# EAGLE schematic sensW5 (EAGLE 9.5.1)
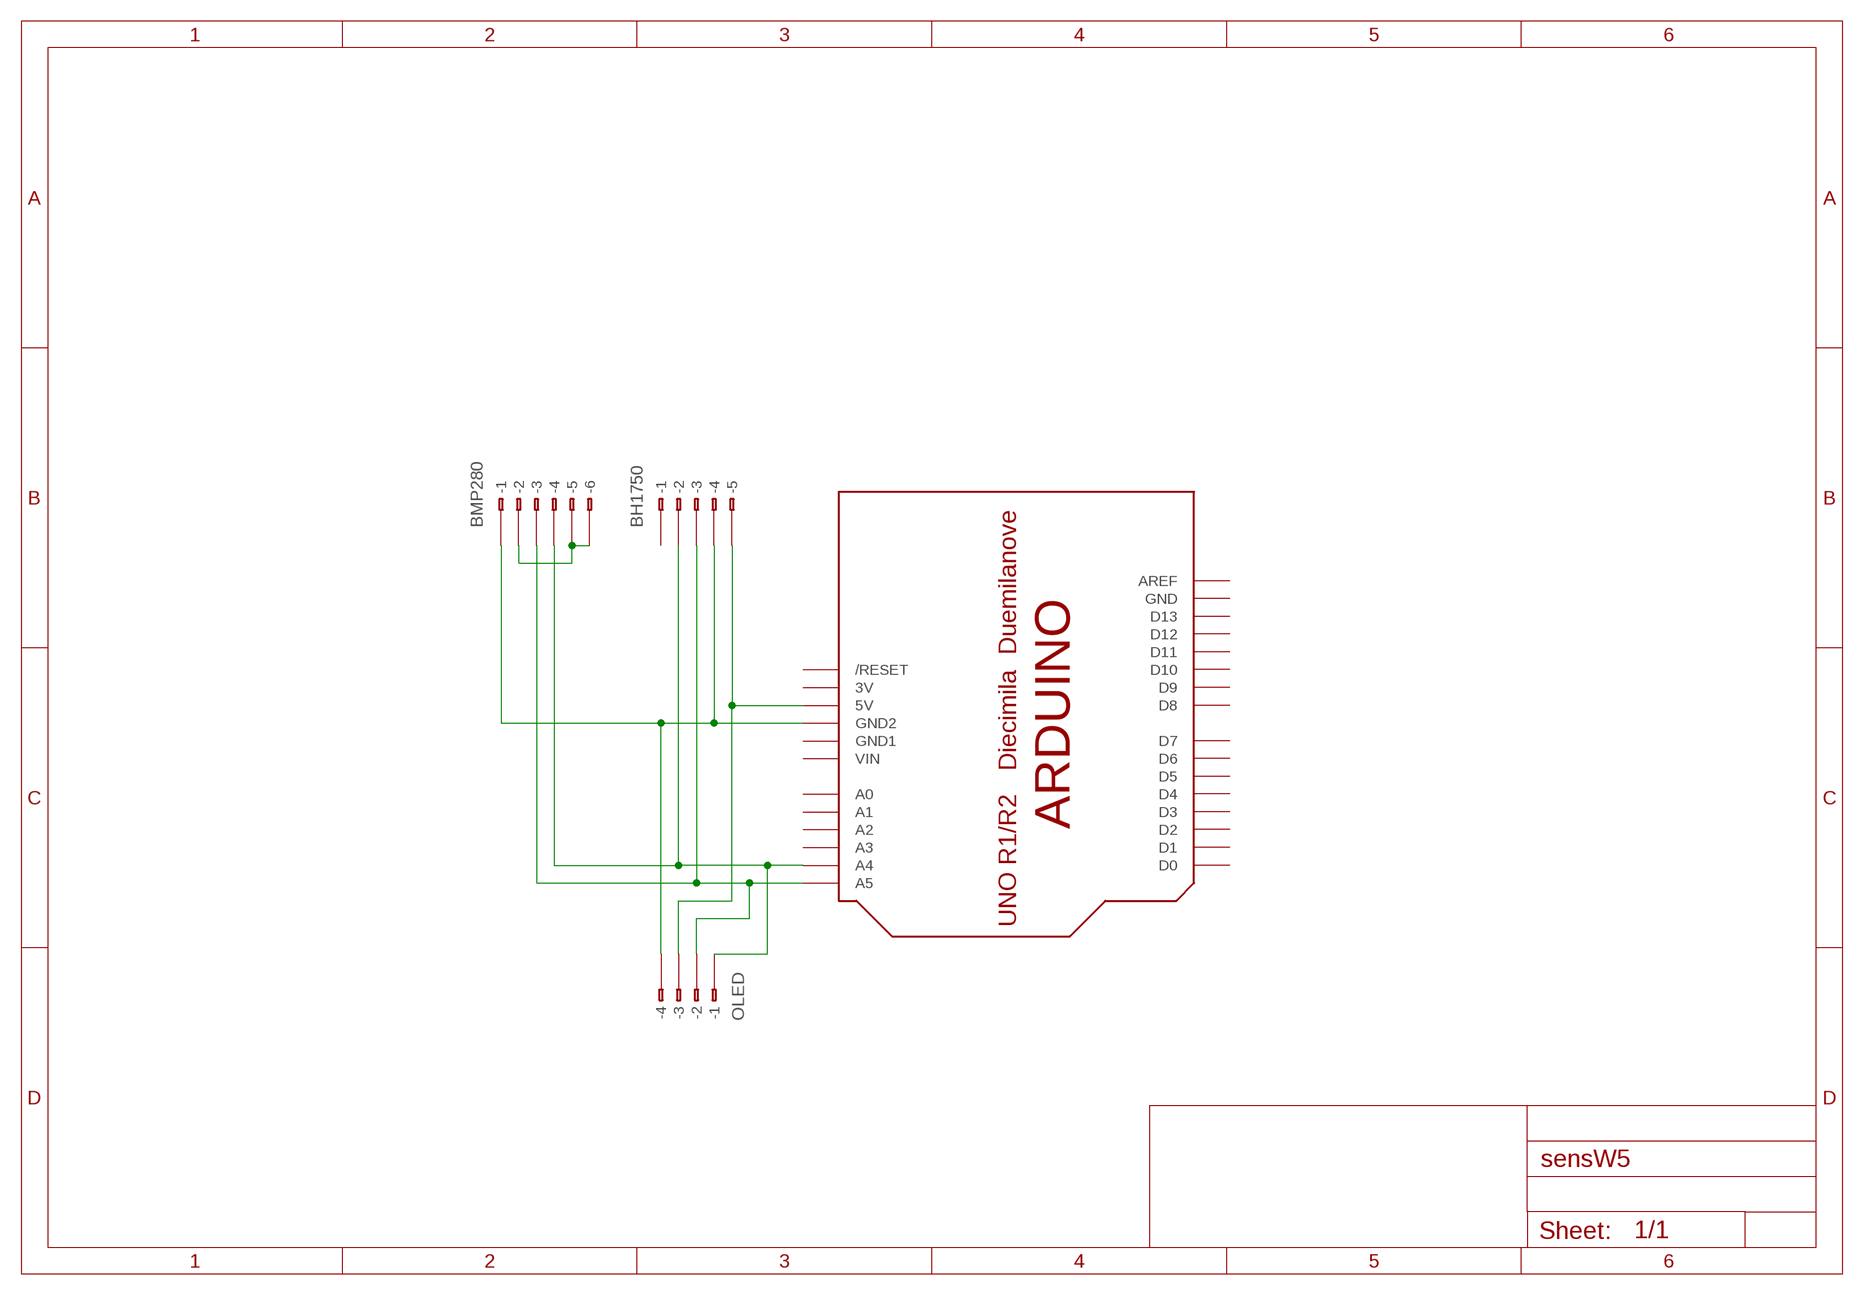
[diagram p0: schematic, sheet 1]

## Parts
BH1750  233-105  [233-105]
BMP280  233-106  [233-106]
OLED  233-104  [233-104]
U$1  ARDUINO-NOHOLE  [ARDUINO-NOHOLE]

## Nets
N$1: BH1750.B5(B-5) OLED.B3(B-3) U$1.5V
N$2: BH1750.B4(B-4) BMP280.B1(B-1) OLED.B4(B-4) U$1.GND2
N$3: BH1750.B3(B-3) BMP280.B3(B-3) OLED.B2(B-2) U$1.A5
N$4: BH1750.B2(B-2) BMP280.B4(B-4) OLED.B1(B-1) U$1.A4
N$5: BMP280.B2(B-2) BMP280.B5(B-5) BMP280.B6(B-6)
Unconnected: BH1750.A1(-1) BH1750.A2(-2) BH1750.A3(-3) BH1750.A4(-4) BH1750.A5(-5) BH1750.B1(B-1) BMP280.A1(-1) BMP280.A2(-2) BMP280.A3(-3) BMP280.A4(-4) BMP280.A5(-5) BMP280.A6(-6) OLED.A1(-1) OLED.A2(-2) OLED.A3(-3) OLED.A4(-4) U$1.A0 U$1.A1 U$1.A2 U$1.A3 U$1.AREF U$1.D0 U$1.D1 U$1.D2 U$1.D3 U$1.D4 U$1.D5 U$1.D6 U$1.D7 U$1.D8 U$1.D9 U$1.D10 U$1.D11 U$1.D12 U$1.D13 U$1.RESET(/RESET)

## Power pins joined to a net without a drawn wire
3V: U$1.3V
GND: U$1.GND
GND1: U$1.GND1
VIN: U$1.VIN

## Library data of the parts
BH1750 = con-wago:233-105: WAGO Cage Clamp; MPN: 233-105; OC_FARNELL: unknown; OC_NEWARK: 28K9047
BMP280 = con-wago:233-106: WAGO Cage Clamp; MPN: 233-106; OC_FARNELL: unknown; OC_NEWARK: 28K9048
OLED = con-wago:233-104: WAGO Cage Clamp; MPN: 233-104; OC_FARNELL: unknown; OC_NEWARK: 28K9046
U$1 = adafruit:ARDUINO: Arduino Diecimila/Duemilanove Make a shield with ease, this package has all the named pins as well as the two mounting drill holes and an outline of the USB and DC power connector. The outline is on the DIMENSION layer, so if your board house uses it they will cut the outline to match. http://www.ladyada.net/library/pcb/eaglelibrary.html